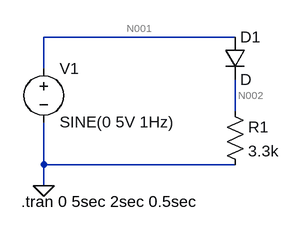
[diagram p0: schematic Draft2.asc]
Draft2.asc, the LTspice schematic file:
Version 4
SHEET 1 880 680
WIRE 224 48 -64 48
WIRE -64 96 -64 48
WIRE 224 160 224 112
WIRE -64 240 -64 176
WIRE 224 240 -64 240
WIRE -64 272 -64 240
FLAG -64 272 0
SYMBOL diode 208 48 R0
SYMATTR InstName D1
SYMBOL res 208 144 R0
SYMATTR InstName R1
SYMATTR Value 3.3k
SYMBOL voltage -64 80 R0
WINDOW 123 0 0 Left 0
WINDOW 39 0 0 Left 0
SYMATTR InstName V1
SYMATTR Value SINE(0 5V 1Hz)
TEXT -98 296 Left 2 !.tran 0 5sec 2sec 0.5sec

The netlist it stands for:
* Draft2.asc
D1 N001 N002 D
R1 N002 0 3.3k
V1 N001 0 SINE(0 5V 1Hz)
.model D D
.lib standard.dio
.tran 0 5sec 2sec 0.5sec
.backanno
.end

* Results of the author's LTspice run, read from the files saved beside the schematic
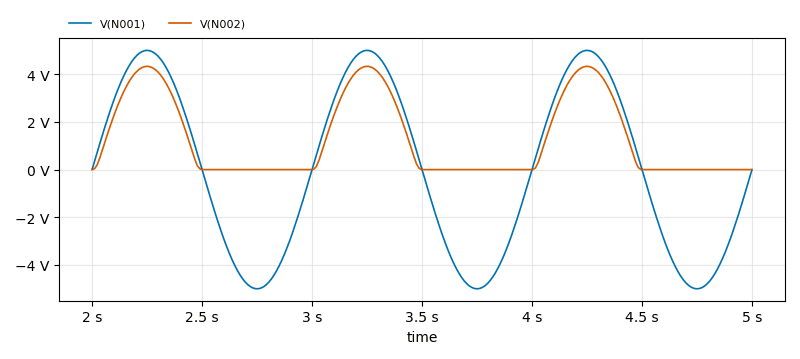
[diagram p1: Transient Analysis of Draft2.asc, plotted from the saved traces]
* Transient Analysis, 1 run:
*   V(N001): min -5 V, max 5 V, average 0 V, rms 3.536 V, last 0 V
*   V(N002): min 0 V, max 4.331 V, average 1.282 V, rms 2.088 V, last 0 V